# Altium schematic sheet Block_Diagram_1.SchDoc
size 558 x 431 mm; SheetNumber: 1; SheetTotal: 3
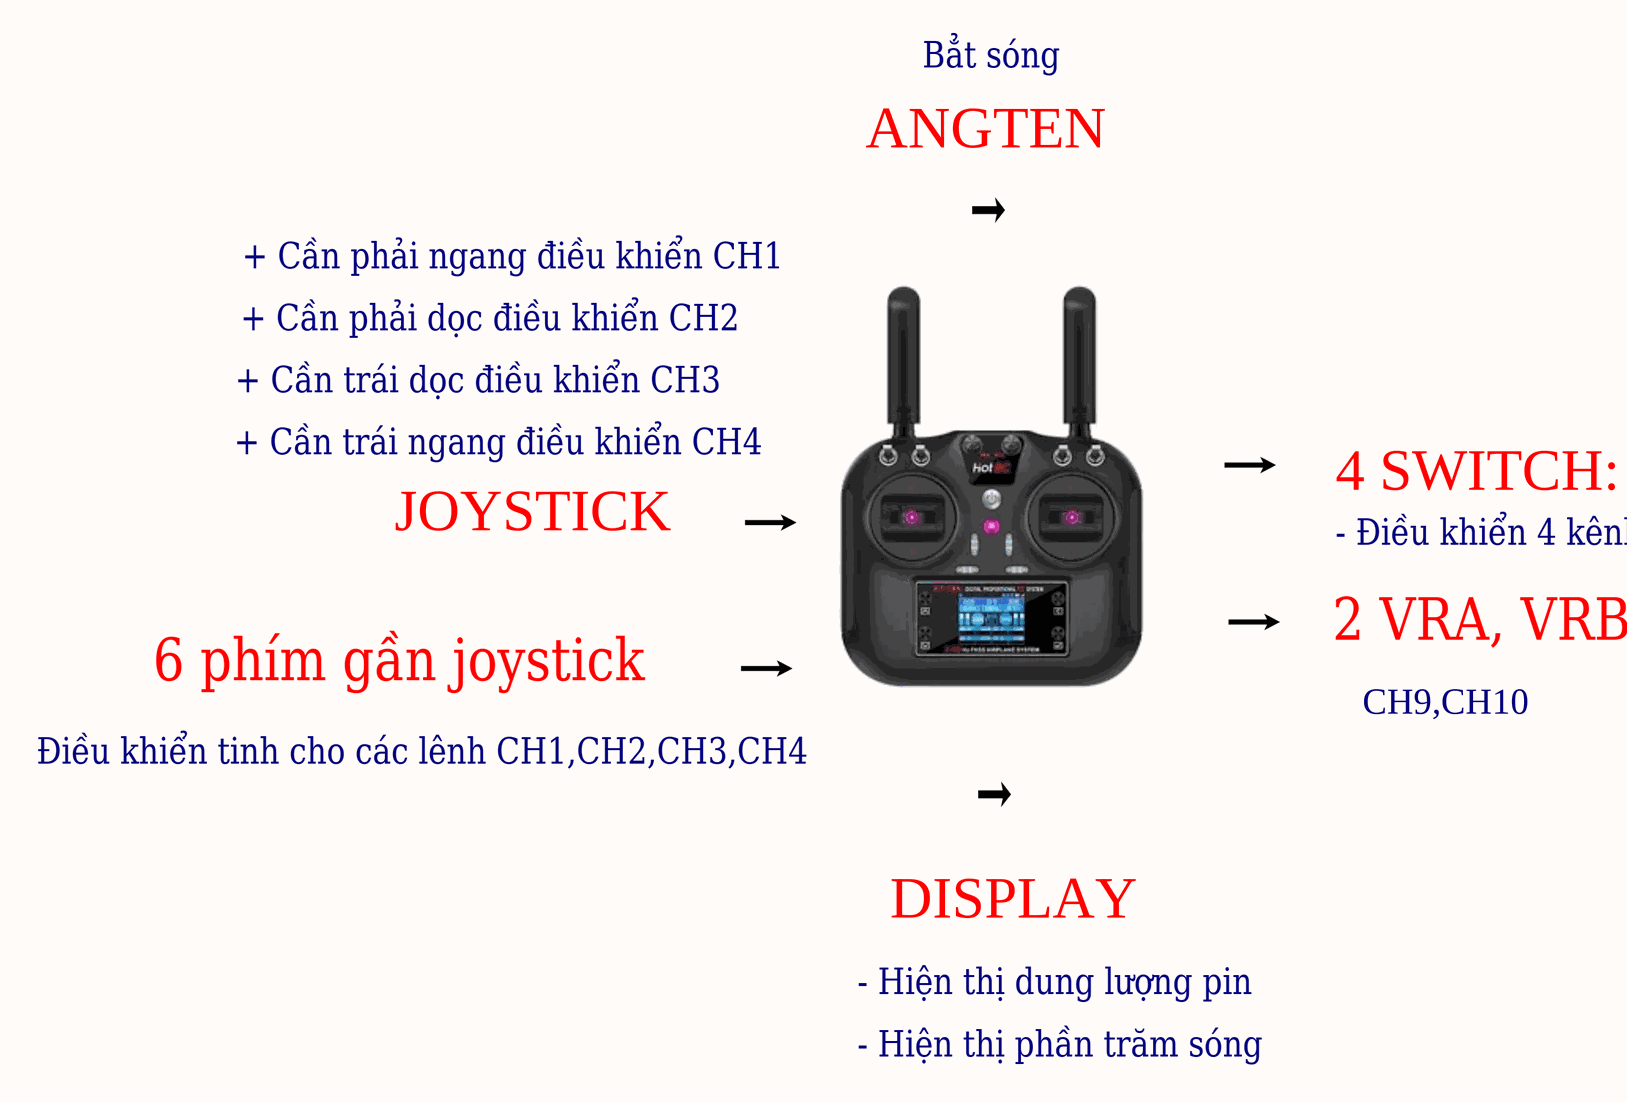
[diagram p0: Block_Diagram_1.SchDoc, left]

## Notes on the sheet
- Bẳt sóng
- ANGTEN
- + Cần phải ngang điều khiển CH1
- + Cần phải dọc điều khiển CH2
- + Cần trái dọc điều khiển CH3
- + Cần trái ngang điều khiển CH4
- 4 SWITCH: SWA,SWB,SWC,SWD
- JOYSTICK
- - Điều khiển 4 kênh CH5,CH6,CH7,CH8 kiểu ON/OFF
- 6 phím gần joystick
- 2 VRA, VRB Có chức năng điều khiển pwm cho các động cơ
- Điều khiển tinh cho các lênh CH1,CH2,CH3,CH4
- CH9,CH10
- DISPLAY
- - Hiện thị dung lượng pin
- - Hiện thị phần trăm sóng
- DWG. NO.
- REV.
- SHT.
- REVISION
- DESCRIPTION
- DATE
- APPROVED
- THIS DOCUMENT AND THE DATA DISCLOSED HEREIN OR HEREWITH IS THE PROPERTY OF ALTIUM LIMITED AND MAY BE FREELY DISTRIBUTED IN WHOLE. NO RIGHTS ARE RESERVED OR EXPRESS OR IMPLIED WARANTEE GIVEN.
- ENG:
- DSN:
- APPROVALS
- PROJECT
- DOCUMENT REVISION:
- DESIGN ITEM:
- CHK:
- BOM:
- REFERENCE DOCUMENTS
- PROJECT REVISION:
- TITLE
- FAB DWG:
- PCB DWG:
- ASSY DWG:
- SCALE:
- SIZE
- C
- CAGE CODE
- FILE NAME
- DWG NO.
- SHEET
- OF
- REV